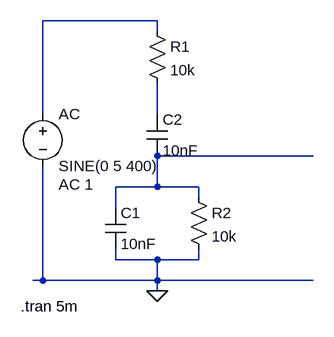
[diagram p0: schematic Draft3.asc]
Draft3.asc, the LTspice schematic file:
Version 4
SHEET 1 880 680
WIRE 160 32 -16 32
WIRE 160 48 160 32
WIRE -16 176 -16 32
WIRE 160 176 160 128
WIRE 400 240 160 240
WIRE 160 288 160 240
WIRE 160 288 96 288
WIRE 224 288 160 288
WIRE 224 304 224 288
WIRE 96 320 96 288
WIRE 96 400 96 384
WIRE 160 400 96 400
WIRE 224 400 224 384
WIRE 224 400 160 400
WIRE -16 432 -16 256
WIRE -16 432 -32 432
WIRE 160 432 160 400
WIRE 160 432 -16 432
WIRE 400 432 160 432
WIRE 160 448 160 432
FLAG 160 448 0
SYMBOL res 144 32 R0
SYMATTR InstName R1
SYMATTR Value 10k
SYMBOL res 208 288 R0
SYMATTR InstName R2
SYMATTR Value 10k
SYMBOL cap 80 320 R0
SYMATTR InstName C1
SYMATTR Value 10nF
SYMBOL cap 144 176 R0
SYMATTR InstName C2
SYMATTR Value 10nF
SYMBOL voltage -16 160 R0
WINDOW 123 24 124 Left 2
WINDOW 39 0 0 Left 0
SYMATTR InstName AC
SYMATTR Value SINE(0 5 400)
SYMATTR Value2 AC 1
TEXT -50 472 Left 2 !.tran 5m

The netlist it stands for:
* Draft3.asc
R1 N001 N002 10k
R2 N003 0 10k
C1 N003 0 10nF
C2 N002 N003 10nF
V§AC N001 0 SINE(0 5 400) AC 1
.tran 5m
.backanno
.end